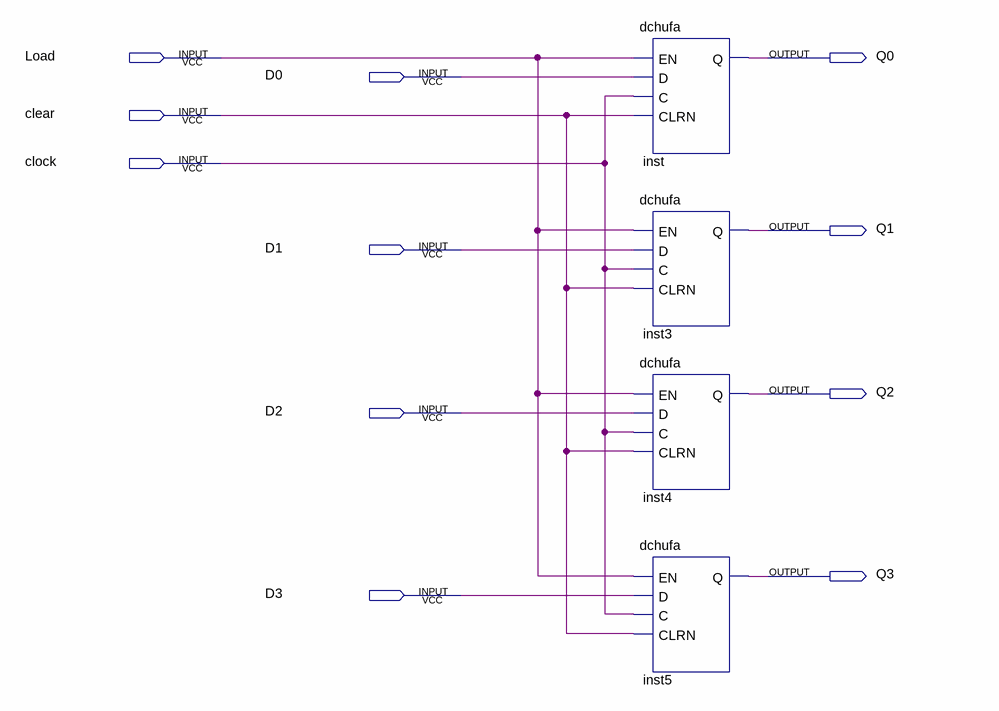
[diagram p0: schematic sheet]
// Quartus schematic jicun.bdf as structural Verilog: 4 symbols, 11 pins
module jicun (
  input  Load,
  input  D0,
  input  clear,
  input  clock,
  input  D1,
  input  D2,
  input  D3,
  output Q0,
  output Q1,
  output Q2,
  output Q3
);

  dchufa inst (.EN(Load), .D(D0), .C(clock), .CLRN(clear), .Q(Q0));
  dchufa inst3 (.EN(Load), .D(D1), .C(clock), .CLRN(clear), .Q(Q1));
  dchufa inst4 (.EN(Load), .D(D2), .C(clock), .CLRN(clear), .Q(Q2));
  dchufa inst5 (.EN(Load), .D(D3), .C(clock), .CLRN(clear), .Q(Q3));
endmodule
